# Altium project angry-bear.PrjPcb
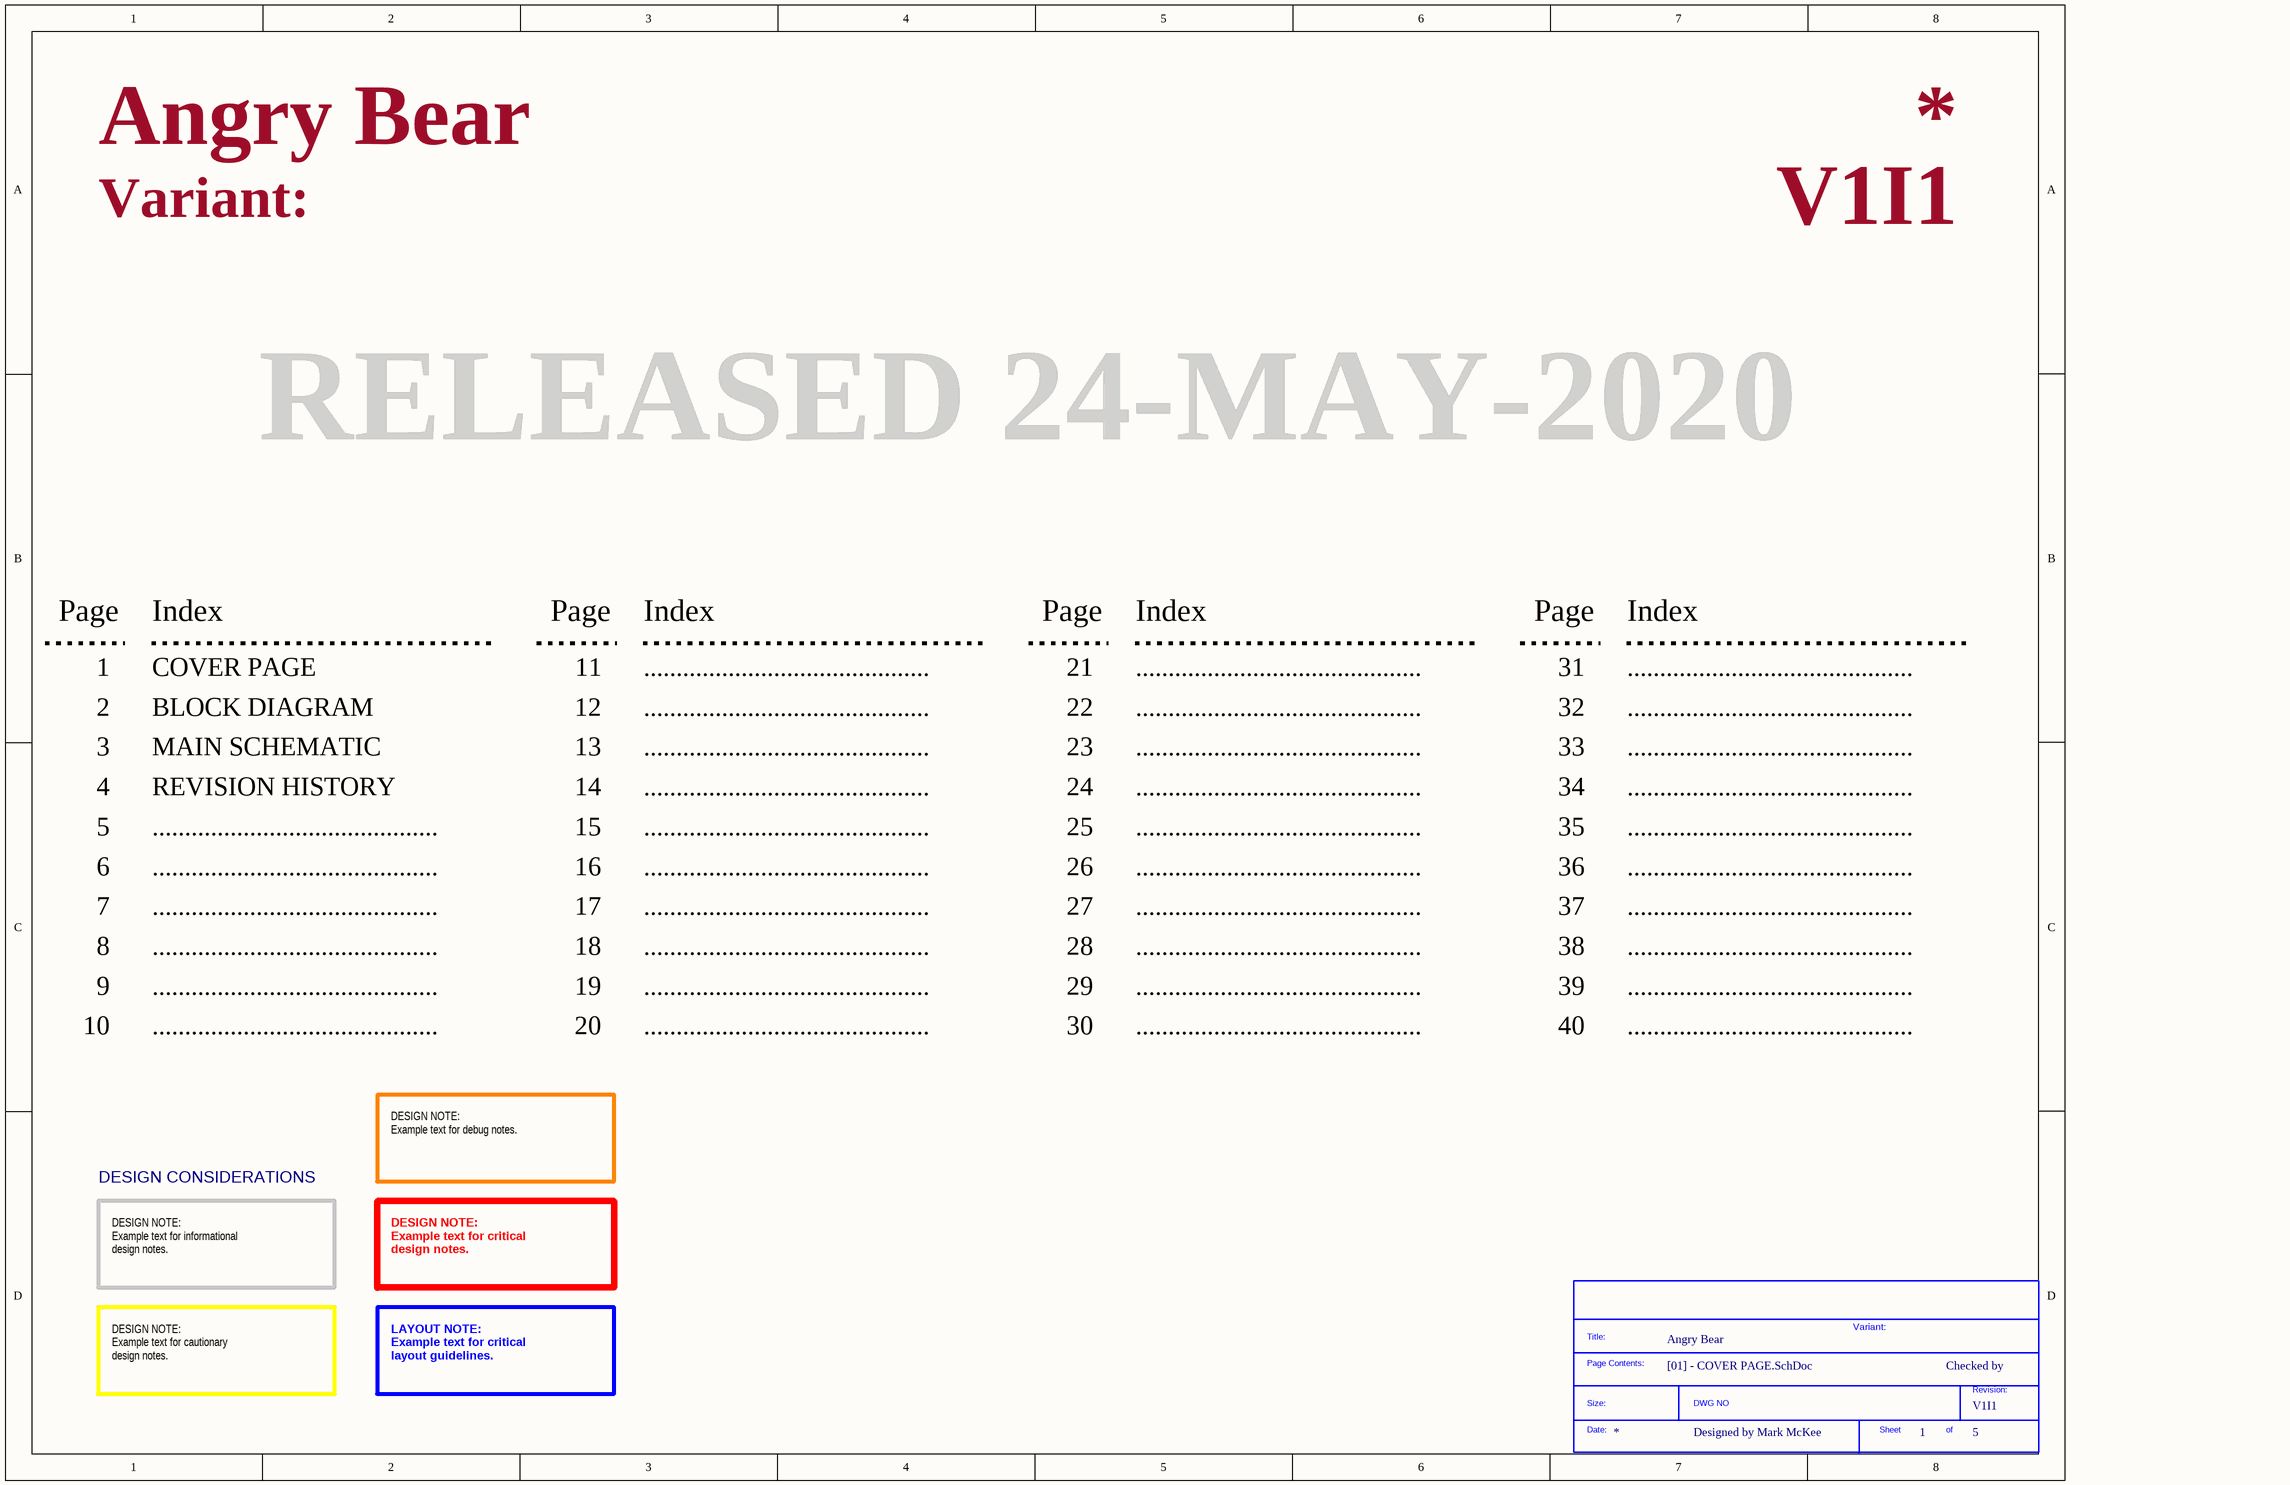
[diagram p0: [01] - COVER PAGE.SchDoc]
Project: Angry Bear; VersionRevision: V1I1
3 sheets, 21 parts. Net scope: global (net labels, ports and power ports of the same name join across sheets).
Sheets:
  [01] - COVER PAGE.SchDoc
  [02] - BLOCK DIAGRAM.SchDoc
  [03] - MAIN SCHEMATIC.SchDoc

## Sheet [01] - COVER PAGE.SchDoc
size A3; DocumentNumber: 1; SheetNumber: 1; SheetTotal: 5

### Parts
(Parts that share a designator on the sheet are numbered #1, #2 ... from top to bottom, then left to right.)
*#1  SDTitleBlock  (value not drawn)  (graphical)

### Notes on the sheet
- Variant:
- RELEASED 24-MAY-2020
- Page
- Index
- 1
- COVER PAGE
- 11
- ............................................
- 21
- 31
- 2
- 3
- BLOCK DIAGRAM
- MAIN SCHEMATIC
- 12
- 13
- 22
- 23
- 32
- 33
- 4
- 5
- REVISION HISTORY
- 14
- 15
- 24
- 25
- 34
- 35
- 6
- 16
- 26
- 36
- 7
- 8
- 17
- 18
- 27
- 28
- 37
- 38
- 9
- 10
- 19
- 20
- 29
- 30
- 39
- 40
- DESIGN NOTE:
  Example text for debug notes.
- DESIGN CONSIDERATIONS
- DESIGN NOTE:
  Example text for informational
  design notes.
- DESIGN NOTE:
  Example text for critical
  design notes.
- Checked by
- DESIGN NOTE:
  Example text for cautionary
  design notes.
- LAYOUT NOTE:
  Example text for critical
  layout guidelines.
- Designed by Mark McKee
- (in symbol SDTitleBlock) Title:; Page Contents:; Revision:; Size:; DWG NO; Date:; Sheet; of

## Sheet [02] - BLOCK DIAGRAM.SchDoc
size A3; DocumentNumber: 2; SheetNumber: 2; SheetTotal: 5; PageSetup: Record=PageOptions|CenterHorizontal=True|CenterVertical=True|PrintScale=0.52|XCorrection=1.00|YCorrection=1.00|PrintKind=1|BorderSize=5000000|LeftOffset=0|BottomOffset=0|Orientation=2|PaperLength=1000|PaperWidth=1000|Scale=100|PaperSource=4|PrintQuality=600|MediaType=1|DitherType=10|PrintScaleMode=1|PaperKind=A4|PaperIndex=9
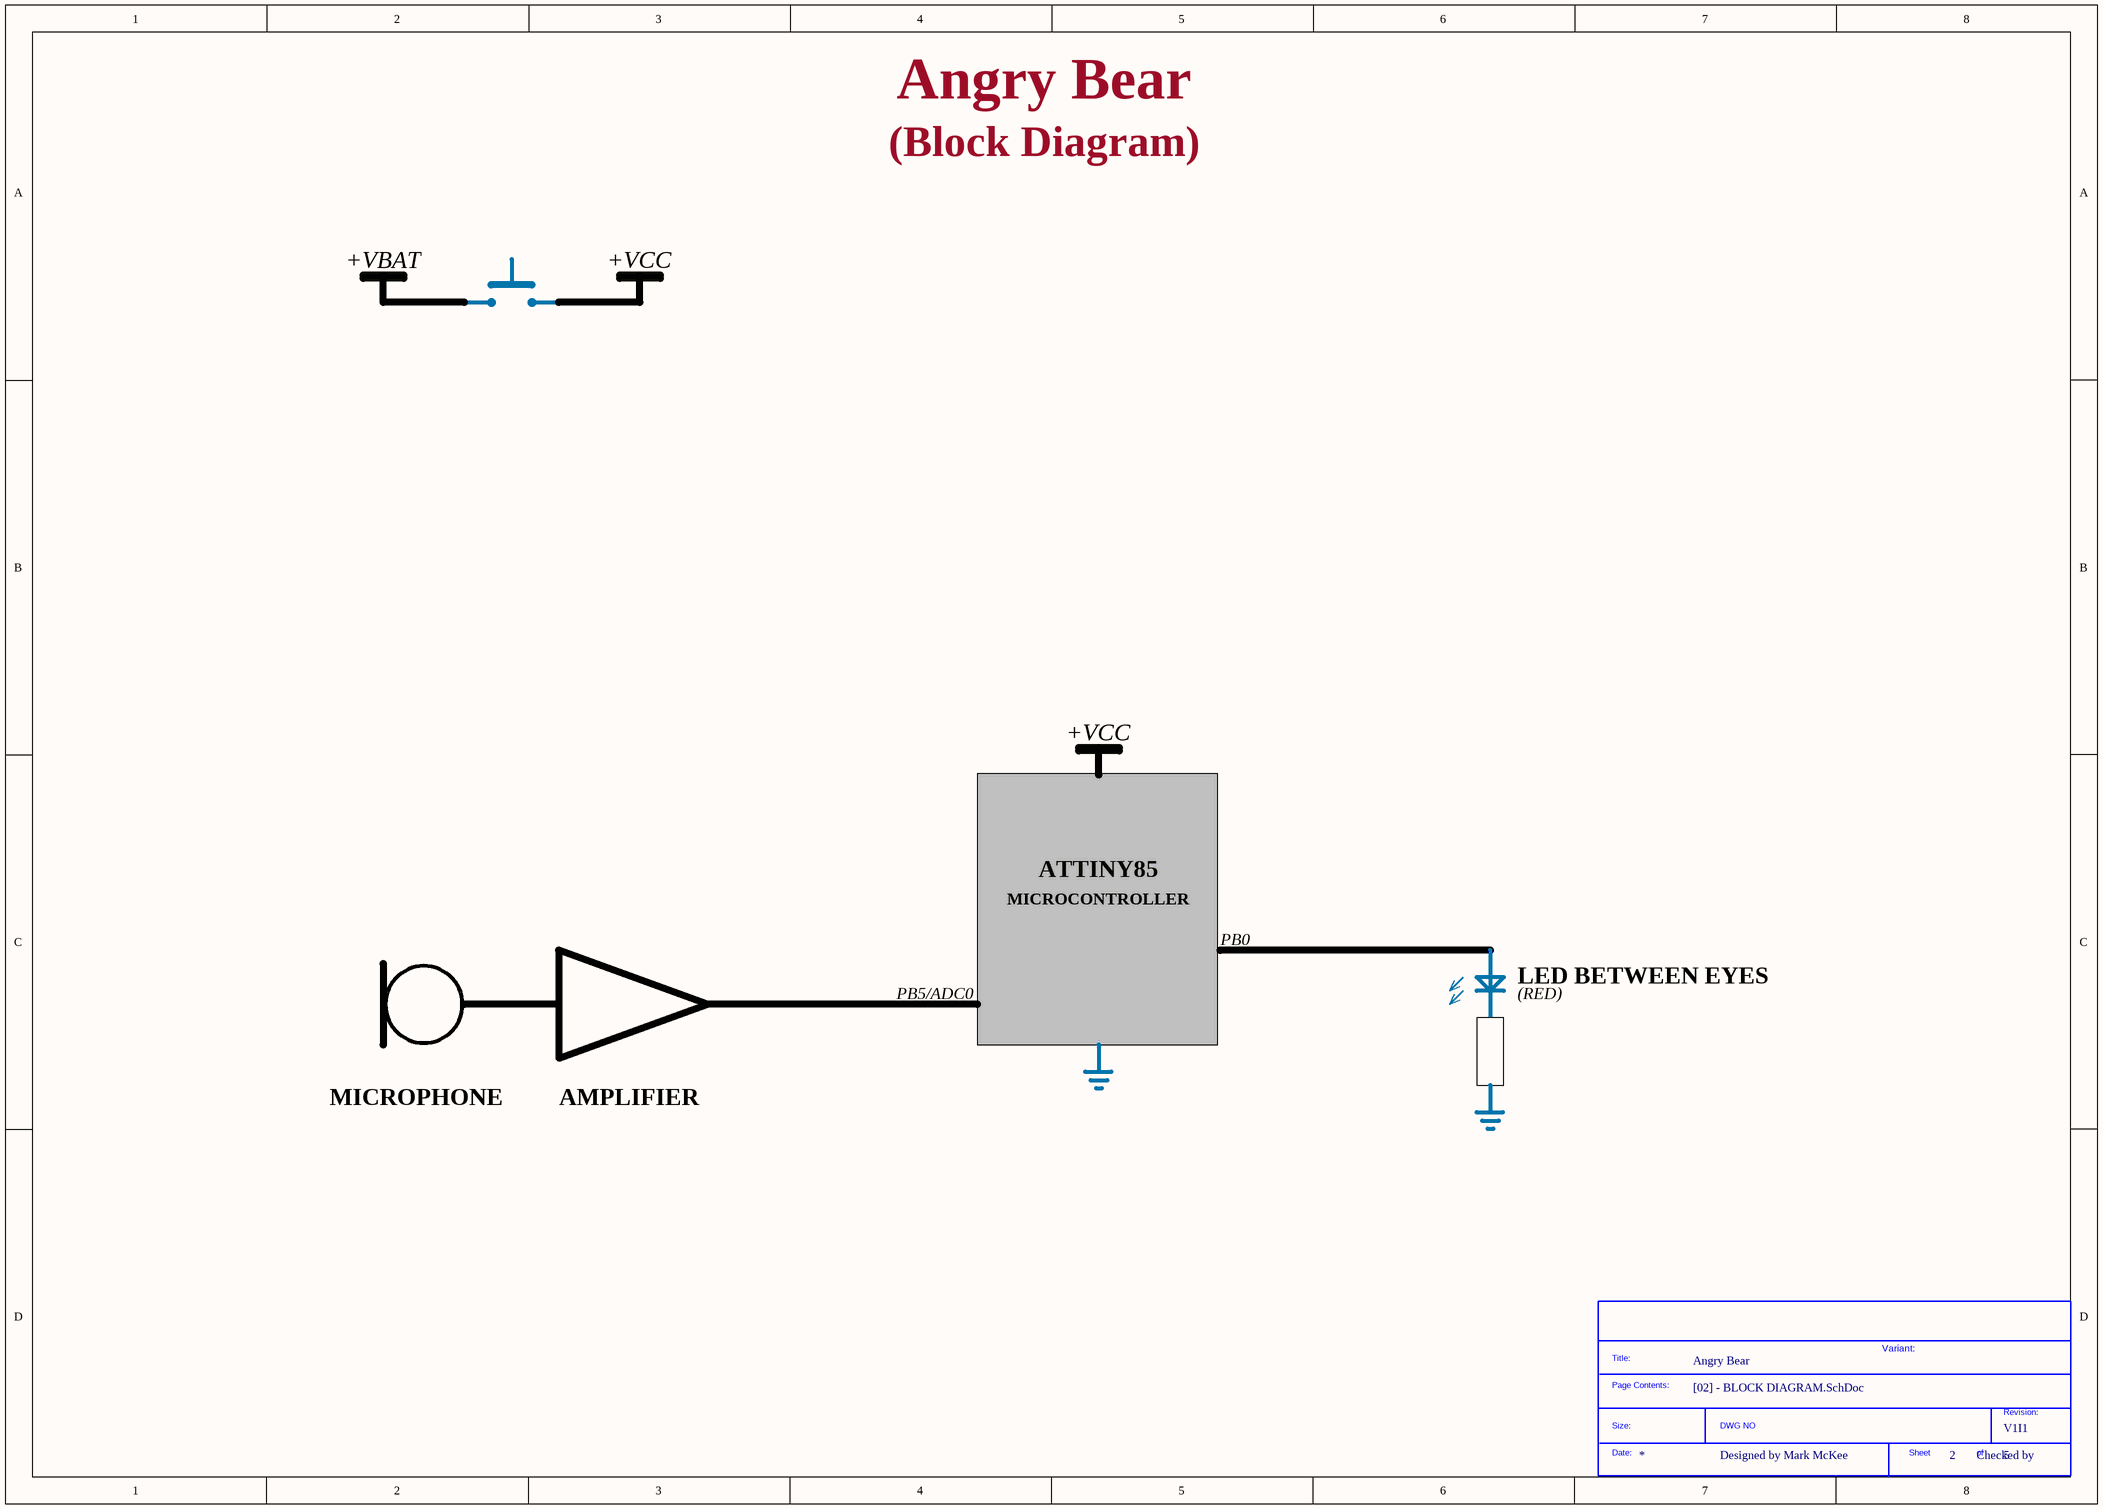
[diagram p1: [02] - BLOCK DIAGRAM.SchDoc]

### Parts
(Parts that share a designator on the sheet are numbered #1, #2 ... from top to bottom, then left to right.)
*#2  SDTitleBlock  (value not drawn)  (graphical)

### Notes on the sheet
- (Block Diagram)
- +VBAT
- +VCC
- ATTINY85
- MICROCONTROLLER
- PB0
- LED BETWEEN EYES
- PB5/ADC0
- (RED)
- MICROPHONE
- AMPLIFIER
- Variant:
- Designed by Mark McKee
- Checked by
- (in symbol SDTitleBlock) Title:; Page Contents:; Revision:; Size:; DWG NO; Date:; Sheet; of

## Sheet [03] - MAIN SCHEMATIC.SchDoc
size A3; DocumentNumber: 2; SheetNumber: 2; SheetTotal: 5; PageSetup: Record=PageOptions|CenterHorizontal=True|CenterVertical=True|PrintScale=0.52|XCorrection=1.00|YCorrection=1.00|PrintKind=1|BorderSize=5000000|LeftOffset=0|BottomOffset=0|Orientation=2|PaperLength=1000|PaperWidth=1000|Scale=100|PaperSource=4|PrintQuality=600|MediaType=1|DitherType=10|PrintScaleMode=1|PaperKind=A4|PaperIndex=9
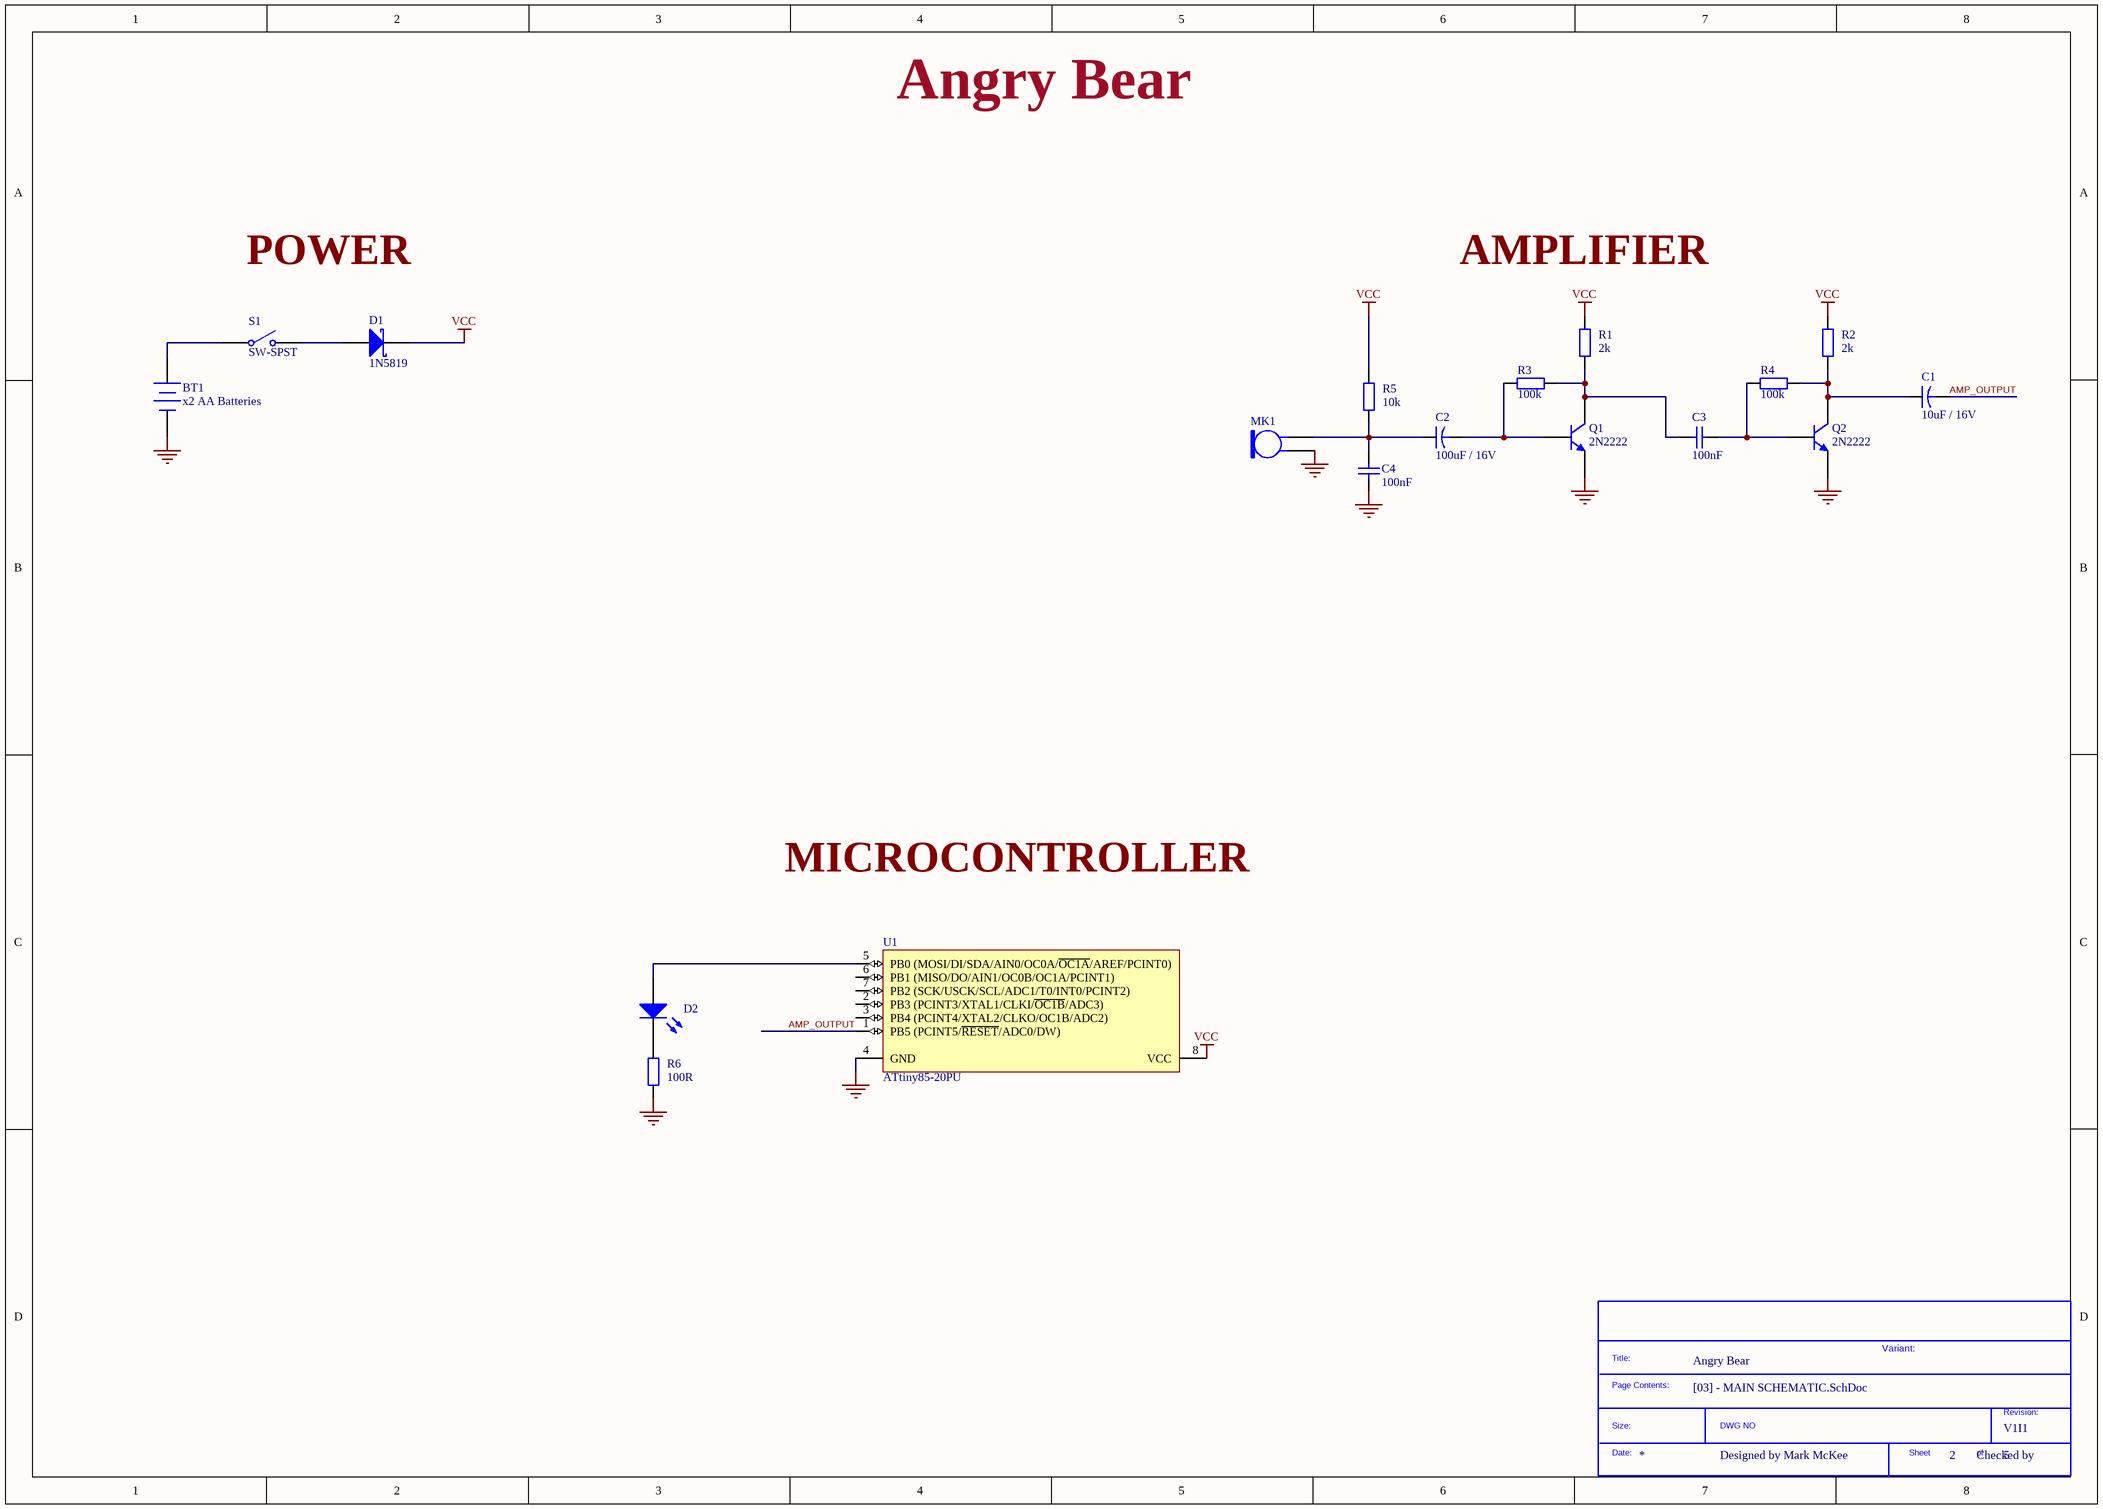
[diagram p2: [03] - MAIN SCHEMATIC.SchDoc]

### Parts
(Parts that share a designator on the sheet are numbered #1, #2 ... from top to bottom, then left to right.)
*#3  SDTitleBlock  (value not drawn)  (graphical)
BT1  x2 AA Batteries  [BAT-2]
C1  10uF / 16V  [CAPR5-4X5]
C2  100uF / 16V  [CAPR5-4X5]
C3  100nF  [RAD-0.3]
C4  100nF  [RAD-0.3]
D1  1N5819  [DO-204AL]
D2  LED0  [LED-0]  (value not drawn)
MK1  Mic2  [PIN2]  (value not drawn)
Q1  2N2222  [TO-226-AA]
Q2  2N2222  [TO-226-AA]
R1  2k  [AXIAL-0.4]
R2  2k  [AXIAL-0.4]
R3  100k  [AXIAL-0.4]
R4  100k  [AXIAL-0.4]
R5  10k  [AXIAL-0.4]
R6  100R  [AXIAL-0.4]
S1  SW-SPST  [SPST-2]
U1  ATtiny85-20PU  [8P3]

### Nets
GND: BT1.2(-) C4.1 MK1.1 Q1.3(E) Q2.3(E) R6.1 U1.4(GND)
VCC: D1.2(K) R1.2 R2.2 R5.2 U1.8(VCC)
AMP_OUTPUT: C1.2 U1.1(PB5_(PCINT5/~{RESET}/ADC0/DW))
NetBT1_1: BT1.1(+) S1.1(COMMON)
NetC1_1: C1.1 Q2.1(C) R2.1 R4.2
NetC2_1: C2.1 C4.2 MK1.2 R5.1
NetC2_2: C2.2 Q1.2(B) R3.1
NetC3_1: C3.1 Q1.1(C) R1.1 R3.2
NetC3_2: C3.2 Q2.2(B) R4.1
NetD1_1: D1.1(A) S1.2(NO)
NetD2_1: D2.1(A) U1.5(PB0_(MOSI/DI/SDA/AIN0/OC0A/~{OC1A}/AREF/PCINT0))
NetD2_2: D2.2(K) R6.2

Not connected (* = marked no-connect by the designer): U1 2(PB3_(PCINT3/XTAL1/CLKI/~{OC1B}/ADC3)) 3(PB4_(PCINT4/XTAL2/CLKO/OC1B/ADC2)) 6(PB1_(MISO/DO/AIN1/OC0B/OC1A/PCINT1)) 7(PB2_(SCK/USCK/SCL/ADC1/T0/INT0/PCINT2))

### Notes on the sheet
- POWER
- AMPLIFIER
- MICROCONTROLLER
- Variant:
- Designed by Mark McKee
- Checked by
- (in symbol SDTitleBlock) Title:; Page Contents:; Revision:; Size:; DWG NO; Date:; Sheet; of

### Library data of the parts
BT1 = Battery: Multicell Battery; Published: 24-Mar-1999; LatestRevisionDate: 17-Jul-2002; LatestRevisionNote: Re-released for DXP Platform.; PackageReference: BAT-2; Publisher: Altium Limited; PackageDescription: Battery; 2 Leads
C1 C2 = Cap2: Capacitor; Value: 100pF; Published: 23-Sep-2002; PackageReference: CAPR5-4X5; Publisher: Altium Limited; PackageDescription: Capacitor; 2 Leads
C3 C4 = Cap: Capacitor; Value: 100pF; Published: 8-Jun-2000; LatestRevisionDate: 17-Jul-2002; LatestRevisionNote: Re-released for DXP Platform.; PackageReference: RAD-0.3; Publisher: Altium Limited; PackageDescription: Radial Cap, Thru-Hole; 2 Leads; 0.3 in Pin Spacing
D1 = Diode 11DQ03: Schottky Rectifier; Published: 8-Jun-2000; LatestRevisionDate: 17-Jul-2002; LatestRevisionNote: Re-released for DXP Platform.; DatasheetVersion: Dec-1997; PackageReference: DO-204AL; Publisher: Altium Limited; PackageDescription: Diode, Axial; Body 5.2 x 2.7 mm (LxDia. max), Lead Dia. 0.86 mm (max); Code_JEDEC: DO-204-AL; ComponentLink1Description: Manufacturer Link; ComponentLink1URL: http://www.irf.com/; ComponentLink2Description: Datasheet; ComponentLink2URL: http://www.irf.com/product-info/datasheets/data/11dq03.pdf
D2 = LED0: Typical INFRARED GaAs LED; Published: 8-Jun-2000; LatestRevisionDate: 08-Jul-2005; LatestRevisionNote: Mech Layer 1 removed.; PackageReference: LED-0; Publisher: Altium Limited; PackageDescription: LED; 2 Leads
MK1 = Mic2: Microphone; Published: 24-Mar-1999; LatestRevisionDate: 17-Jul-2002; LatestRevisionNote: Re-released for DXP Platform.; PackageReference: PIN2; Publisher: Altium Limited
Q1 Q2 = NPN: NPN Bipolar Transistor; Manufacturer: ON Semiconductor; Manufacturer Part Number: P2N2222AG; Collector Emitter Voltage V(br)ceo: 40V; Transition Frequency ft: 300MHz; Power Dissipation Pd: 625mW; DC Collector Current: 600mA; DC Current Gain hFE: 300hFE; Transistor Case Style: TO-92; No. of Pins: 3Pins; SVHC: No SVHC (17-Dec-2015); Published: 8-Jun-2000; LatestRevisionDate: 17-Jul-2002; LatestRevisionNote: Re-released for DXP Platform.; PackageReference: TO-226-AA; Publisher: Altium Limited; PackageDescription: TO, Flat Index; 3 In-Line, Axial Leads; Body Dia. 4.8mm; Leads 0.55 x 0.51 mm (max); Code_JEDEC: TO-226-AA; Supplier 1: Newark; Supplier Part Number 1: 42K2503; Stock 1: 0; Transistor Polarity: NPN; Operating Temperature Max: 150°C; Product Range: -; Automotive Qualification Standard: -; MSL: MSL 1 - Unlimited; ComponentLink1URL: https://www.onsemi.com/pub/Collateral/P2N2222A-D.PDF?src-supplier=Digi-Key; ComponentLink1Description: https://www.onsemi.com/pub/Collateral/P2N2222A-D.PDF?src-supplier=Digi-Key; ComponentLink2URL: http://www.mouser.com/ds/2/308/on%20semiconductor_p2n2222a-d-548821.pdf?src-supplier=Mouser; ComponentLink2Description: http://www.mouser.com/ds/2/308/on%20semiconductor_p2n2222a-d-548821.pdf?src-supplier=Mouser; ComponentLink3URL: http://www.onsemi.com/pub/Collateral/P2N2222A-D.PDF?src-supplier=Avnet; ComponentLink3Description: http://www.onsemi.com/pub/Collateral/P2N2222A-D.PDF?src-supplier=Avnet; ComponentLink4URL: http://www.onsemi.com/pub/Collateral/P2N2222A-D.PDF?src-supplier=Avnet+Europe; ComponentLink4Description: http://www.onsemi.com/pub/Collateral/P2N2222A-D.PDF?src-supplier=Avnet+Europe; ComponentLink5URL: http://www.onsemi.com/pub_link/Collateral/P2N2222A-D.PDF?src-supplier=Future+Electronics; ComponentLink5Description: http://www.onsemi.com/pub_link/Collateral/P2N2222A-D.PDF?src-supplier=Future+Electronics; ComponentLink6URL: https://www.verical.com/server-webapp/html/getDatasheet?partID=69103&src-supplier=Verical; ComponentLink6Description: https://www.verical.com/server-webapp/html/getDatasheet?partID=69103&src-supplier=Verical
R1-R6 = Res2: Resistor; Value: 1K; Published: 8-Jun-2000; LatestRevisionDate: 17-Jul-2002; LatestRevisionNote: Re-released for DXP Platform.; PackageReference: AXIAL-0.4; Publisher: Altium Limited; PackageDescription: Axial Device, Thru-Hole; 2 Leads; 0.4 in Pin Spacing
S1 = SW-SPST: Single-Pole, Single-Throw Switch; Published: 24-Mar-1999; LatestRevisionDate: 17-Jul-2002; LatestRevisionNote: Re-released for DXP Platform.; PackageReference: SPST-2; Publisher: Altium Limited; PackageDescription: Switch; 2 Leads
U1 = ATtiny85-20PU: Low Power tinyAVR® 8-Bit Microcontroller, 8K Flash Memory, 20MHz, Industrial Temperature, 8-Lead PDIP, Pb-Free; Published: 20-Nov-2009; DatasheetVersion: DOC2586I, May-2008; PackageVersion: revB, Jan-2002; PackageReference: 8P3; Publisher: Altium Limited; PackageDescription: 8-Lead, 0.300" Wide Body, Plastic Dual In-Line Package (PDIP); Supplier 1: Digi-Key; Supplier Part Number 1: ATTINY85-20PU-ND; Supplier 2: Farnell; Supplier Part Number 2: 1455162; Supplier 3: Mouser; Supplier Part Number 3: 556-ATTINY85-20PU; Code_JEDEC: MS-001-BA; ComponentLink1Description: Manufacturer Link; ComponentLink1URL: http://www.atmel.com/products/AVR/tinyavr.asp?; ComponentLink2Description: Datasheet; ComponentLink2URL: http://www.atmel.com/dyn/resources/prod_documents/doc2586.pdf; ComponentLink3Description: Atmel.com Home; ComponentLink3URL: http://www.atmel.com